# Altium schematic sheet Sheet1.SchDoc
size A
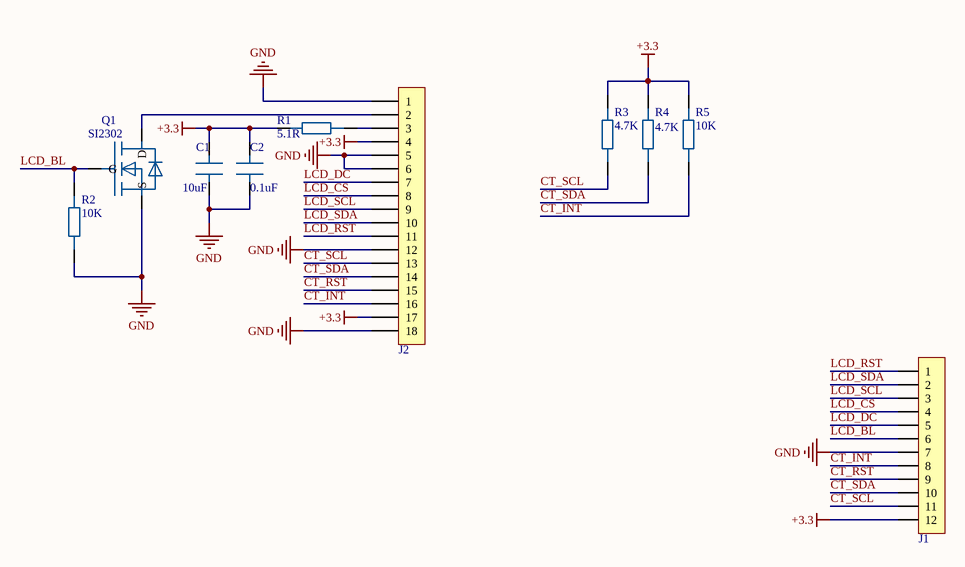
[diagram p0: Sheet1.SchDoc]

## Parts
C1  10uF  [0402C]
C2  0.1uF  [0402C]
J1  CON1X12  [CON1X12 2.54mm]  (value not drawn)
J2  Handler 1X18  [0.5mm 18P 无锁 FPC连接座]  (value not drawn)
Q1  SI2302  [SOT-23]
R1  5.1R  [0402R]
R2  10K  [0402R]
R3  4.7K  [0402R]
R4  4.7K  [0402R]
R5  10K  [0402R]

## Nets
+3.3: C1.2 C2.2 J1.12 J2.4 J2.17 R1.1 R3.1 R4.1 R5.1
GND: C1.1 C2.1 J1.7 J2.1 J2.5 J2.6 J2.12 J2.18 Q1.2(S) R2.2
CT_INT: J1.8 J2.16 R5.2
CT_RST: J1.9 J2.15
CT_SCL: J1.11 J2.13 R3.2
CT_SDA: J1.10 J2.14 R4.2
LCD_BL: J1.6 Q1.1(G) R2.1
LCD_CS: J1.4 J2.8
LCD_DC: J1.5 J2.7
LCD_RST: J1.1 J2.11
LCD_SCL: J1.3 J2.9
LCD_SDA: J1.2 J2.10
NetJ2_2: J2.2 Q1.3(D)
NetJ2_3: J2.3 R1.2

## Library data of the parts
C1 C2 = Cap: 电容
J1 = Handler 1X12: 接线端子
J2 = Handler 1X18: 接线端子
Q1 = NMOS: N沟道场效应管
R1-R5 = Res: 电阻